# Altium project PlusBit PCB.PrjPcb
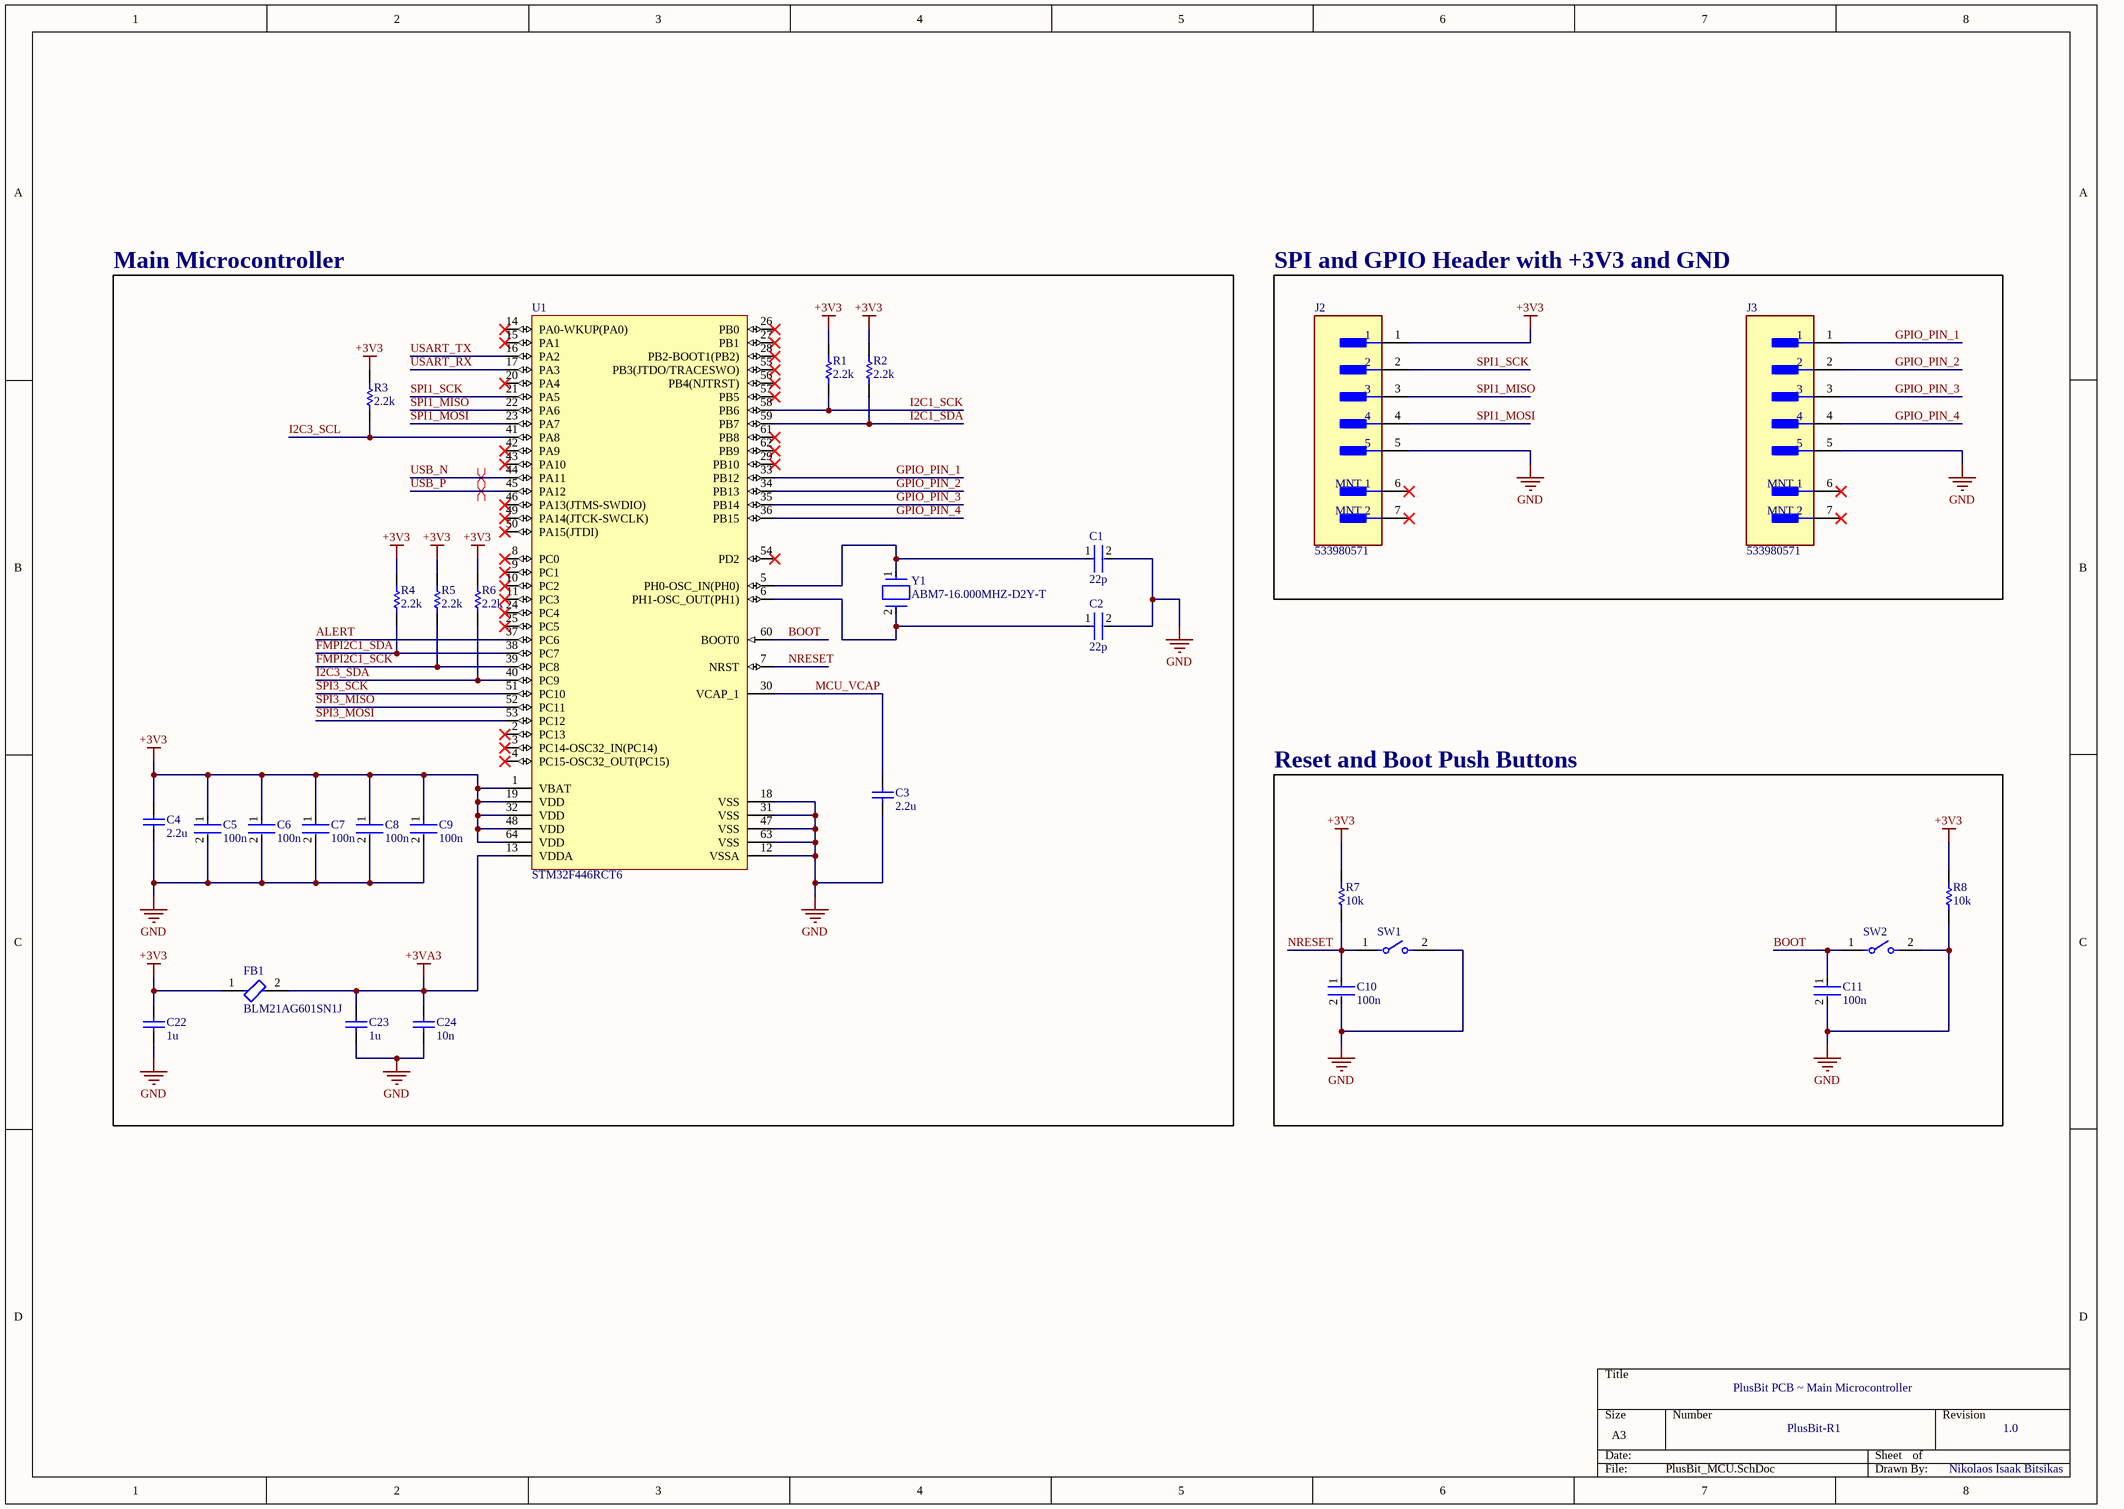
[diagram p0: PlusBit_MCU.SchDoc]
5 sheets, 66 parts. Net scope: global (net labels, ports and power ports of the same name join across sheets).
Board file: PlusBit_PCB.PcbDoc
Sheets:
  PlusBit_MCU.SchDoc
  PlusBit_PowerSupply.SchDoc
  PlusBit_ExtraModule.SchDoc
  PlusBit_ExtraMemory.SchDoc
  PlusBit_Sensors.SchDoc

## Sheet PlusBit_MCU.SchDoc
size A3; SheetNumber: 1; SheetTotal: 5

### Parts
C1  22p  [FP-C1206C-EB-MFG]
C2  22p  [FP-C1206C-EB-MFG]
C3  2.2u  [CAPC2013X145X50ML20T25]
C4  2.2u  [CAPC2013X145X50ML20T25]
C5  100n  [FP-C0402-BB-MFG]
C6  100n  [FP-C0402-BB-MFG]
C7  100n  [FP-C0402-BB-MFG]
C8  100n  [FP-C0402-BB-MFG]
C9  100n  [FP-C0402-BB-MFG]
C10  100n  [FP-C0402-BB-MFG]
C11  100n  [FP-C0402-BB-MFG]
C22  1u  [CAPC2013X135X45LL10T25]
C23  1u  [CAPC2013X135X45LL10T25]
C24  10n  [CAPC2013X88X50LL20T25]
FB1  BLM21AG601SN1J  [FP-BLM21-0_2-t0_85-e0_5-IPC_A]
J2  533980571  [FP-533980571-MFG]
J3  533980571  [FP-533980571-MFG]
R1  2.2k  [RESC1608X55X25LL10T15]
R2  2.2k  [RESC1608X55X25LL10T15]
R3  2.2k  [RESC1608X55X25LL10T15]
R4  2.2k  [RESC1608X55X25LL10T15]
R5  2.2k  [RESC1608X55X25LL10T15]
R6  2.2k  [RESC1608X55X25LL10T15]
R7  10k  [RESC2013X60X35NL10T20]
R8  10k  [RESC1608X55X25ML10T15]
SW1  FSM2JART  [FP-FSM2JART-MFG]  (value not drawn)
SW2  FSM2JART  [FP-FSM2JART-MFG]  (value not drawn)
U1  STM32F446RCT6  [STM-LQFP64_L]
Y1  ABM7-16.000MHZ-D2Y-T  [FP-ABM7-MFG]

### Blocks framed on the sheet
Main Microcontroller: C1-C9 C22-C24 FB1 R1-R6 U1 Y1
SPI and GPIO Header with +3V3 and GND: J2 J3
Reset and Boot Push Buttons: C10 C11 R7 R8 SW1 SW2

### Nets
+3V3: C4.2 C5.1 C6.1 C7.1 C8.1 C9.1 C22.2 FB1.1 J2.1 R1.2 R2.2 R3.2 R4.2 R5.2 R6.2 R7.2 R8.2 U1.1(VBAT) U1.19(VDD) U1.32(VDD) U1.48(VDD) U1.64(VDD)
+3VA3: C23.2 C24.2 FB1.2 U1.13(VDDA)
GND: C1.2 C2.2 C3.1 C4.1 C5.2 C6.2 C7.2 C8.2 C9.2 C10.2 C11.2 C22.1 C23.1 C24.1 J2.5 J3.5 R8.1 SW1.2 SW2.2 U1.12(VSSA) U1.18(VSS) U1.31(VSS) U1.47(VSS) U1.63(VSS)
ALERT: U1.37(PC6)
BOOT: C11.1 SW2.1 U1.60(BOOT0)
FMPI2C1_SCK: R5.1 U1.39(PC8)
FMPI2C1_SDA: R4.1 U1.38(PC7)
GPIO_PIN_1: J3.1 U1.33(PB12)
GPIO_PIN_2: J3.2 U1.34(PB13)
GPIO_PIN_3: J3.3 U1.35(PB14)
GPIO_PIN_4: J3.4 U1.36(PB15)
I2C1_SCK: R1.1 U1.58(PB6)
I2C1_SDA: R2.1 U1.59(PB7)
I2C3_SCL: R3.1 U1.41(PA8)
I2C3_SDA: R6.1 U1.40(PC9)
MCU_VCAP: C3.2 U1.30(VCAP_1)
NRESET: C10.1 R7.1 SW1.1 U1.7(NRST)
SPI1_MISO: J2.3 U1.22(PA6)
SPI1_MOSI: J2.4 U1.23(PA7)
SPI1_SCK: J2.2 U1.21(PA5)
SPI3_MISO: U1.52(PC11)
SPI3_MOSI: U1.53(PC12)
SPI3_SCK: U1.51(PC10)
USART_RX: U1.17(PA3)
USART_TX: U1.16(PA2)
USB_N: U1.44(PA11)
USB_P: U1.45(PA12)
NetC1_1: C1.1 U1.5(PH0-OSC_IN(PH0)) Y1.1
NetC2_1: C2.1 U1.6(PH1-OSC_OUT(PH1)) Y1.2

Not connected (* = marked no-connect by the designer): J2 6(MNT_1)* 7(MNT_2)*; J3 6(MNT_1)* 7(MNT_2)*; U1 2(PC13)* 3(PC14-OSC32_IN(PC14))* 4(PC15-OSC32_OUT(PC15))* 8(PC0)* 9(PC1)* 10(PC2)* 11(PC3)* 14(PA0-WKUP(PA0))* 15(PA1)* 20(PA4)* 24(PC4)* 25(PC5)* 26(PB0)* 27(PB1)* 28(PB2-BOOT1(PB2))* 29(PB10)* 42(PA9)* 43(PA10)* 46(PA13(JTMS-SWDIO))* 49(PA14(JTCK-SWCLK))* 50(PA15(JTDI))* 54(PD2)* 55(PB3(JTDO/TRACESWO))* 56(PB4(NJTRST))* 57(PB5)* 61(PB8)* 62(PB9)*

### Layout directives
differential pair: USB_N, USB_P

### Notes on the sheet
- PlusBit PCB ~ Main Microcontroller
- PlusBit-R1
- 1.0
- Nikolaos Isaak Bitsikas

### Library data of the parts
C1 C2 = CMP-1037-00978-2: 1206 22pF Ceramic Multilayer Capacitor; 50VDC; 125degC; C0G Dielec; +/-5% SMD; Manufacturer Part Number: C1206C220J5GACTU; Manufacturer: KEMET; Automotive Grade: Grade 0; Temperature Coefficient: 15%; Tolerance: 0.05; Voltage Rating: 50 V; Height: 0.88mm; Mouser Description: 1206 22pF Ceramic Multilayer Capacitor; 50VDC; 125degC; C0G Dielec; +/-5% SMD; Ipc Land Pattern Name: CAPC320160X78; Temperature Range High: +150°C; Automotive: Yes; Device Class L3: Ceramic Capacitors; ComponentLink2Description: Datasheet; Temperature: -55°C to +150°C; Lead Free: Yes; Category: Cap; Device Class L2: Capacitors; Device Class L1: Passive Components; Value: 22 pF; Capacitance: 22 pF; Digikey Description: 1206 22pF Ceramic Multilayer Capacitor; 50VDC; 125degC; C0G Dielec; +/-5% SMD; Octopart: https://octopart.com/c1206c220j5gactu-kemet-131912; Material: Ceramic; Temperature Characteristic: C0G; Package: C1206C-EB; RoHS: TRUE; ComponentLink2URL: https://content.kemet.com/datasheets/KEM_C1007_X8R_ULTRA_150C_SMD.pdf; Temperature Range Low: -55°C
C3 C4 = CMP-1036-04819-2: Part Number: C0805C225K9PACTU; Manufacturer: Kemet
C5-C9 C11 = CMP-2008-02046-2: CAP CER 0.1UF 10V X5R 0402; Manufacturer: Kemet; Manufacturer Part Number: C0402C104K8PACTU; Material: Ceramic; Capacitance: 0.10 μF; Temperature Coefficient: 15%; Tolerance: 0.1; Value: 0.10 μF; Package: C0402-BB; Temperature: -55°C to +125°C; ComponentLink2Description: Datasheet; Temperature Characteristic: X5R; Device Class L1: Passive Components; Height: 0.55mm; Lead Free: Yes; ComponentLink2URL: https://content.kemet.com/datasheets/KEM_C1002_X7R_SMD.pdf; Device Class L2: Capacitors; Temperature Range Low: -55°C; Temperature Range High: +125°C; RoHS: TRUE; Octopart: https://octopart.com/c0402c104k8pactu-kemet-140039; Automotive: No; Mouser Description: Capacitor 100 nF 10 VDC 0402; Category: Cap; Voltage Rating: 10 V; Digikey Description: CAP CER 0.1UF 10V X5R 0402; Ipc Land Pattern Name: CAPC10050X50; Device Class L3: Ceramic Capacitors
C10 = CMP-2008-02108-2: CAP CER 0.1UF 16V X7R 0402; Manufacturer: Kemet; Manufacturer Part Number: C0402C104K4RACTU; Value: 0.10 μF; Tolerance: 0.1; Material: Ceramic; Temperature Coefficient: 15%; Voltage Rating: 16 V; Package: C0402-BB; Automotive: No; Ipc Land Pattern Name: CAPC10050X50; Device Class L3: Ceramic Capacitors; Capacitance: 0.10 μF; Octopart: https://octopart.com/c0402c104k4ractu-kemet-94158; Temperature Characteristic: X7R; Mouser Description: Cap Ceramic 0.1uF 16V X7R 10% SMD 0402 125?C Paper T/R - Tape and Reel (Alt: C0402C104K4RAC TU); ComponentLink2Description: Datasheet; Temperature Range Low: -55°C; RoHS: TRUE; Device Class L1: Passive Components; Temperature Range High: +125°C; Device Class L2: Capacitors; ComponentLink2URL: https://content.kemet.com/datasheets/KEM_C1002_X7R_SMD.pdf; Category: Cap; Height: 0.55mm; Temperature: -55°C to +125°C; Lead Free: Yes; Digikey Description: CAP CER 0.1UF 16V X7R 0402
C22 C23 = CMP-1036-04761-2: Manufacturer: Murata; Part Number: GRM21BR71H105KA12L
C24 = CMP-2007-00266-1: Manufacturer: Kemet; Part Number: C0805C103K5RACTU
FB1 = CMP-0686-00643-3: Chip Ferrite Bead, 0805, 600Ω @ 100MHz, 0.2Ω, 25%, 700mA; Current Rating: 600mA; Impedance: 600R; DC Resistance (DCR): 210mR; Max Current Rating: 200mA; Number of Circuits: 1; RoHS Compliant: Yes; Test Frequency: 100MHz; Number of Pins: 2; Case Code (Metric): 2012; Depth: 0.85mm; Height: 1.25mm; Case Code (Imperial): 0805; Case/Package: 0805; DC Current: 200mA; Max Operating Temperature: 125°C; Core Material: Ferrite; Length: 2.2mm; Tolerance: 25%; Packaging: Tape and Reel; Min Operating Temperature: -55°C; Radiation Hardening: No; Termination: Flat
J2 J3 = CMP-2000-05250-2: CONN HEADER SMD 5POS 1.25MM; Manufacturer: Molex; Number Of Contacts: 5; Conn Orientation: Vertical; Current Rating: 1A; Voltage Rating: 125V; Conn Gender: Male; Standoff Height: 0.05mm; Package: CONN_HDR5; Contact Material: Tin,Nickel; ComponentLink2Description: Datasheet; Footprint Url: https://www.molex.com/pdm_docs/sd/533980571_sd.pdf; Device Class L3: unset; Manufacturer Part Number: 533980571; Digikey Description: CONN HEADER SMD 5POS 1.25MM; Automotive: No; Lead Free: Yes; Device Class L1: Connectors; Temperature Range High: +105°C; Number Of Rows: 1; Mouser Description: Wire-To-Board Connector, Vertical, PicoBlade 53398 Series, Surface Mount, Header, 5, 1.25 mm; Octopart: https://octopart.com/53398-0571-molex-655292; ComponentLink2URL: https://www.molex.com/webdocs/datasheets/pdf/en-us/0533980571_PCB_HEADERS.pdf; Category: Conn; Device Class L2: Headers and Wire Housings; Pitch: 1.25mm; Ipc Land Pattern Name: HDRV5W64P254_1X5_2032X64X457; RoHS: TRUE; Temperature: -40°C to +105°C; Height: 4.9mm; Temperature Range Low: -40°C
R1-R6 = CMP-2000-06934-1: Thick Film Resistor, 2.2 KOhm, 100 mW, 50 V, +/- 1%, -55 to 155 degC, 2-Pin SMD (0603), RoHS, Tape and Reel; Manufacturer: Yageo; Resistance: 2.2kOhms; Temperature Coefficient: 100PPM/C; Voltage Rating: 50V; Power Rating: 100mW; Tolerance: 1%; Datasheet Version: Rev. 7, 05/2017; Case Code - mm: 1608; Series: RC; Mounting Technology: SurfaceMount; Package Description: 2-Pin Surface Mount Device, Body 1.6 x 0.8 mm; Case Code - in: 0603; Package Reference: 0603; Product: ThickFilmResistorsGeneralPurpose; Manufacturer URL: http://www.yageo.com/; Termination Style: SMD/SMT; Operating Temperature Range: -55Cto+155C; Datasheet URL: http://www.yageo.com/documents/recent/PYu-RC_Group_51_RoHS_L_7.pdf; Packaging: Reel
R7 = CMP-1659-00013-4: Chip Resistor, 10 KOhm, +/- 1%, 0.125 W, -55 to 155 degC, 0805 (2012 Metric), RoHS, Tape and Reel; Manufacturer: Yageo; Voltage Rating: 150 V; Mount: Surface Mount; ComponentLink1Description: Manufacturer URL; ComponentLink2URL: http://www.yageo.com/documents/recent/PYu-RC_Group_51_RoHS_L_04.pdf; Pins: 2; Length: 2 mm; Min Operating Temperature: -55 degC; Height: 0.5 mm; Mounting Technology: Surface Mount; RoHSCompliant: true; REACH SVHC: No SVHC; ComponentLink1URL: http://www.yageo.com/; Max Operating Temperature: 155 degC; PackageReference: 0805; DatasheetVersion: Rev. 4, 02/2016; Package Quantity: 5000; Packaging: Tape and Reel; ComponentLink2Description: Datasheet; PackageDescription: 2-Pin Surface Mounted Device, Body 2 x 1.25 mm
R8 = CMP-2000-05022-1: Resistor, 10 KOhm, +/- 5%, 100 mW, -55 to 155 degC, 0603 (1608 Metric), RoHS, Tape and Reel; Manufacturer: Yageo; Resistance: 10kOhms; Voltage Rating: 50V; Temperature Coefficient: 100PPM/C; Power Rating: 100mW; Package Reference: 603; Series: RC; Case Code - mm: 1608; Packaging: Reel; Datasheet URL: http://www.farnell.com/datasheets/443971.pdf; Datasheet Version: Rev. 4, 04/2009; Operating Temperature Range: -55Cto+155C; Product: ThickFilmResistorsGeneralPurpose; Package Description: 2-Pin Surface Mount Device, Body 1.6 x 0.8 mm; Manufacturer URL: http://www.yageo.com/; Case Code - in: 0603; Tolerance: 5%; Termination Style: SMD/SMT
SW1 SW2 = CMP-03407-000009-1: SWITCH TACTILE SPST-NO 0.05A 12V; Actuator Length: 0.7mm; Switch Function: Off-Mom; Throw Configuration: SPST; Electrical Life: 100000Cycles; Illumination Type: Non-Illuminated; Contact Resistance: 100mR; Operating Force: 260gf; Actuator Type: Standard; Actuator Material: Resin; Contact Current Rating: 50mA; Type: Switch; Contact Plating: Silver; ELV: Compliant; Lead Free: Lead Free; Max Voltage Rating (DC): 12V; Min Operating Temperature: -35°C; Mount: Through Hole; Series: FSMJRT; Max Operating Temperature: 105°C; RoHS Compliant: Yes; Termination: Solder; REACH SVHC: No SVHC; Contact Material: Copper Alloy; Orientation: Straight; Current Rating: 50mA; Package Quantity: 1000; Voltage Rating (DC): 12V; Packaging: Tape and Reel
U1 = CMP-0243-00216-1: ARM Cortex-M4 32-bit MCU+FPU, 256 KB Flash, 128 KB Internal RAM, 50 I/Os, 64-Pin LQFP, -40 to 85 degC, Tray; Operating Frequency(F) (Processor speed) (MHz): 180; Internal RAM Size (kB): 128; I/Os (High Current): 50; FLASH Size (Prog) (kB): 256; D/A Converter: 2; Supply Voltage(Vcc) min (V): 1.7; Mounting Technology: Surface Mount; DatasheetVersion: Rev. 6; ComponentLink1URL: http://www.st.com/; Package Description: LQFP64; ComponentLink1Description: Manufacturer URL; Packing: Tray; ComponentLink2Description: Datasheet; Core: ARM Cortex-M4; Package Reference: 64-Pin Low-profile Quad Flat Package, Body 10 x 10 mm, Pitch 0.5 mm; ComponentLink2URL: http://www.st.com/st-web-ui/static/active/en/resource/technical/document/datasheet/DM00141306.pdf
Y1 = CMP-27762-000095-1: Crystal 16MHz ±20ppm 18pF SMD-2 6mm x 3.5mm; ESR (Equivalent Series Resistance): 50R; Frequency Stability: 30ppm; Width: 3.3mm; Frequency: 16MHz; Radiation Hardening: No; Height: 0.055inch; Tolerance: 20ppm; Length: 6mm; Case/Package: CSMD; Lead Free: Lead Free; Min Operating Temperature: -40°C; Termination: SMD/SMT; Operating Frequency: 16 MHz; Resistor Type: Ceramic; Packaging: Tape and Reel; Mount: Surface Mount; Load Capacitance: 18pF; Frequency Tolerance: 20ppm; Depth: 3.5mm; Series: ABM7; Package Quantity: 1000; Max Operating Temperature: 85°C; Number of Pins: 2

## Sheet PlusBit_PowerSupply.SchDoc
size A4; SheetNumber: 2; SheetTotal: 5
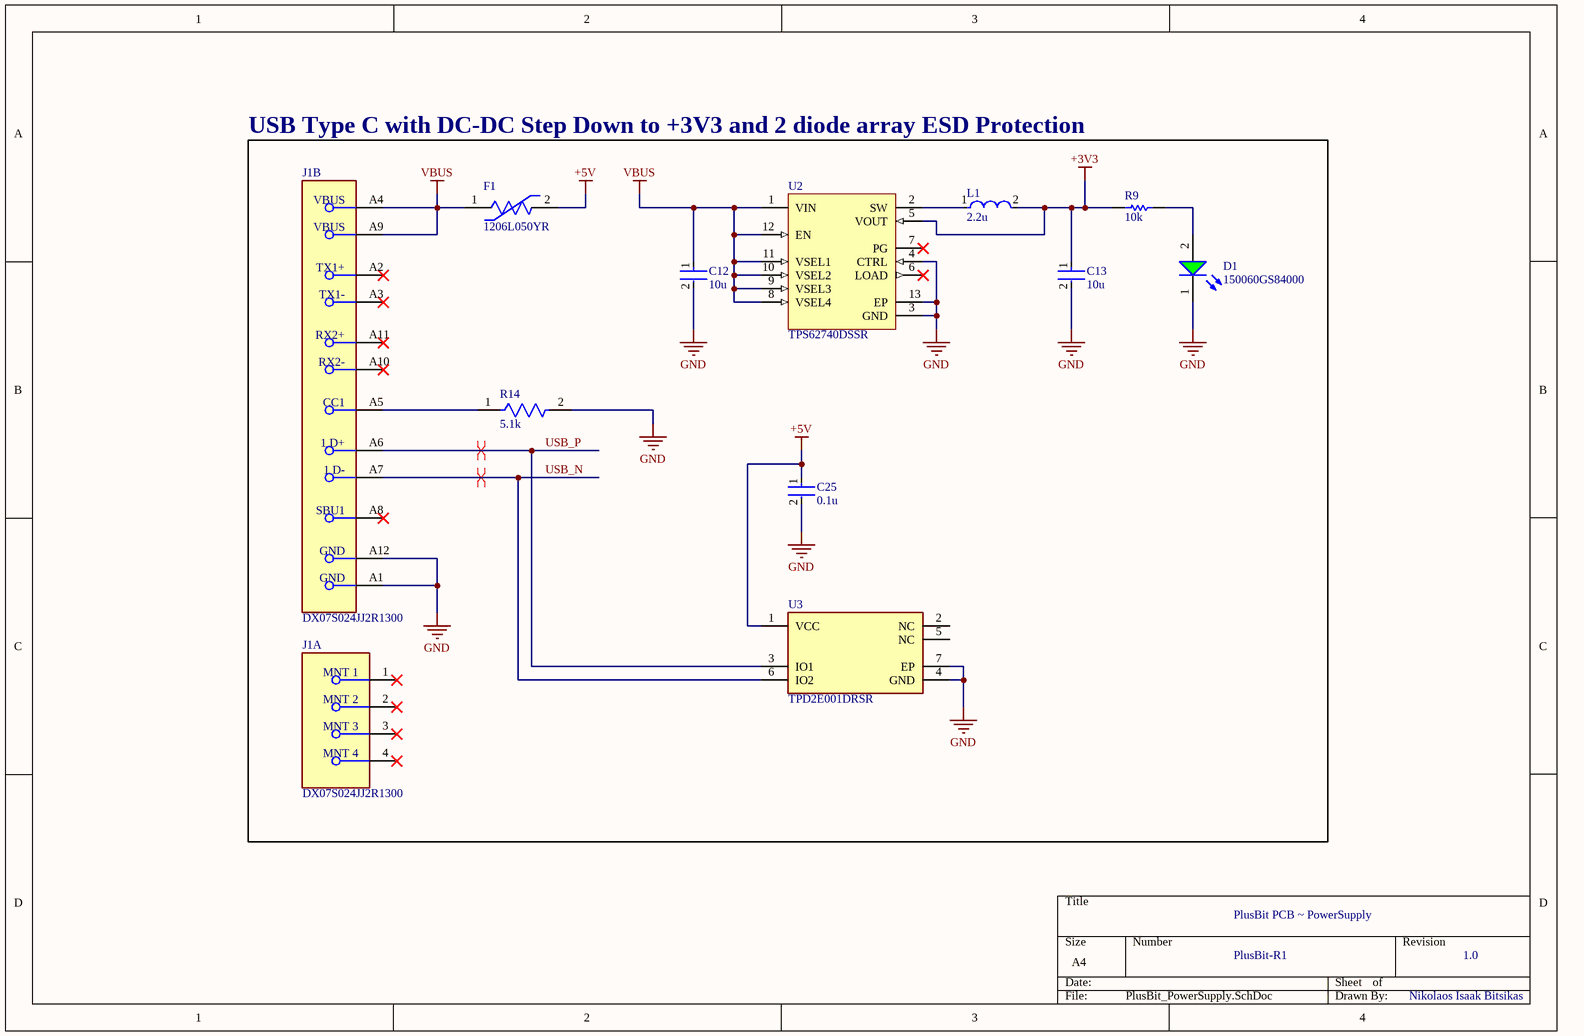
[diagram p1: PlusBit_PowerSupply.SchDoc]

### Parts
C12  10u  [FP-GRM188-0_1-e0_2_0_55-IPC_A]
C13  10u  [FP-GRM188-0_1-e0_2_0_55-IPC_A]
C25  0.1u  [FP-C0402-BB-MFG]
D1  150060GS84000  [WL-SMCW_0603_150060xx8x000]
F1  1206L050YR  [FP-1206L050YR-MFG]
J1  DX07S024JJ2R1300  [FP-DX07S024JJ2R1300-MFG]  (parts A,B of 3)
L1  2.2u  [FP-LQM2HPN_G0-IPC_C]
R9  10k  [RESC1608X55X25ML10T15]
R14  5.1k  [FP-CRCW0603-e3-IPC_C]
U2  TPS62740DSSR  [DSS0012A_V]
U3  TPD2E001DRSR  [FP-DRS0006A-MFG]

### Nets
+3V3: C13.1 L1.2 R9.2 U2.5(VOUT)
+5V: C25.1 F1.2 U3.1(VCC)
GND: C12.2 C13.2 C25.2 D1.1(K) J1.A1(GND) J1.A12(GND) R14.2 U2.3(GND) U2.4(CTRL) U2.13(EP) U3.4(GND) U3.7(EP)
VBUS: C12.1 F1.1 J1.A4(VBUS) J1.A9(VBUS) U2.1(VIN) U2.8(VSEL4) U2.9(VSEL3) U2.10(VSEL2) U2.11(VSEL1) U2.12(EN)
USB_N: J1.A7(1_D-) U3.6(IO2)
USB_P: J1.A6(1_D+) U3.3(IO1)
NetD1_2: D1.2(A) R9.1
NetJ1_A5: J1.A5(CC1) R14.1
NetL1_1: L1.1 U2.2(SW)

Not connected (* = marked no-connect by the designer): J1 1(MNT_1)* 2(MNT_2)* 3(MNT_3)* 4(MNT_4)* A2(TX1+)* A3(TX1-)* A8(SBU1)* A10(RX2-)* A11(RX2+)*; U2 6(LOAD)* 7(PG)*; U3 2(NC) 5(NC)

### Layout directives
differential pair: USB_N, USB_P

### Notes on the sheet
- USB Type C with DC-DC Step Down to +3V3 and 2 diode array ESD Protection
- PlusBit PCB ~ PowerSupply
- PlusBit-R1
- 1.0
- Nikolaos Isaak Bitsikas

### Library data of the parts
C12 C13 = CMP-2006-02792-2: Chip Multilayer Ceramic Capacitors for General Purpose, 0603, 10uF, X5R, 15%, 20%, 6.3V; Packaging: Tape and Reel; Voltage Rating (DC): 6.3V; Width: 0.031inch; Termination: SMD/SMT; Dielectric: X5R; Package Quantity: 4000; Voltage Rating: 6.3V; Capacitance: 10uF; Case/Package: 0603; Min Operating Temperature: -55°C; Voltage: 6.3V; Length: 1.6mm; Thickness: 0.035inch; Lead Free: Lead Free; Depth: 0.8mm; Case Code (Imperial): 0603; Max Operating Temperature: 85°C; Material: Ceramic; Height: 0.8mm; Tolerance: 20%; Mount: Surface Mount; REACH SVHC: No SVHC; Radiation Hardening: No; Case Code (Metric): 1608
C25 = CMP-2008-02108-2: as C10 on sheet PlusBit_MCU; Voltage Rating: 16 V; Package: C0402-BB; Automotive: No; Ipc Land Pattern Name: CAPC10050X50; Device Class L3: Ceramic Capacitors; Capacitance: 0.10 μF; Octopart: https://octopart.com/c0402c104k4ractu-kemet-94158; Temperature Characteristic: X7R; Mouser Description: Cap Ceramic 0.1uF 16V X7R 10% SMD 0402 125?C Paper T/R - Tape and Reel (Alt: C0402C104K4RAC TU); ComponentLink2Description: Datasheet; Temperature Range Low: -55°C; RoHS: TRUE; Device Class L1: Passive Components; Temperature Range High: +125°C; Device Class L2: Capacitors; ComponentLink2URL: https://content.kemet.com/datasheets/KEM_C1002_X7R_SMD.pdf; Category: Cap; Height: 0.55mm; Temperature: -55°C to +125°C; Lead Free: Yes; Digikey Description: CAP CER 0.1UF 16V X7R 0402
D1 = CMP-03913-108242102-2: WL-SMCW SMT Mono-color Chip LED Waterclear; Forward Voltage: 3.3V; Dominant Wavelength: 525nm; Max Reverse Voltage (DC): 5V; Viewing Angle: 40°; Luminous Intensity: 3cd; Peak Wavelength: 520nm; Forward Current: 30mA; Length: 1.6mm; Height: 950µm; Max Operating Temperature: 85°C; Min Operating Temperature: -40°C; RoHS: Compliant; Width: 800µm
F1 = CMP-08606-000073-1: PTC RESET FUSE 6V 500MA 1206; Trip Current: 1A; Current Rating: 100A; Resistance: 700mR; Approvals: cULus; Max Power Dissipation: 600mW; Time to Trip: 0.1s; Hold Current: 500mA; Min Operating Temperature: -40°C; Voltage Rating (DC): 6V; Working Voltage: 6V; Package Quantity: 4000; Termination: SMD/SMT; Lead Free: Lead Free; REACH SVHC: No SVHC; Series: 1206L; Max Voltage Rating (DC): 6V; Height: 0.75mm; Terminal Material: Copper; Packaging: Tape and Reel; Case Code (Imperial): 1206; Length: 3.4mm; RoHS Compliant: Yes; Operating Supply Voltage: 6V; Case Code (Metric): 3216; Width: 1.8mm; Max Current Rating: 100A; Case/Package: 1206; Power Dissipation: 600mW; Max Operating Temperature: 85°C; Voltage Rating: 6V
J1 = CMP-19038-000004-1: CONN RCP USB3.1 TYPEC 24P SMD RA; Number of Contacts: 24; Gender: Receptacle; Connector Type: USB; Features: Shielded; Packaging: Tape and Reel; Mount: Surface Mount; RoHS Compliant: Yes
L1 = CMP-1662-00028-2: Multilayer Type Inductor for Power Lines, 1008 (2520), 2.2μH, 20%, 0.1Ω, 1.3A; Core Material: Ferrite; DC Resistance (DCR): 100mR; Inductance: 2.2uH; Test Frequency: 1MHz; Self Resonant Frequency: 40MHz; Shielding: Shielded; Depth: 2.2mm; Length: 2.5mm; Max DC Current: 1.3A; Military Standard: Not; Current Rating: 1.3A; Termination: SMD/SMT; Radiation Hardening: No; Tolerance: 20%; Height: 1.2mm; Case Code (Metric): 2520; DC Current: 1.3A; Inductance Tolerance: 20%; Packaging: Tape and Reel; Width: 2mm; REACH SVHC: No SVHC; Mount: Surface Mount; Max Operating Temperature: 125°C; Lead Free: Lead Free; Case/Package: 1008; Case Code (Imperial): 1008; Series: LQM2HP_G0; Height - Seated (Max): 0.039inch; Package Quantity: 3000; Min Operating Temperature: -55°C
R9 = CMP-2000-05022-1: as R8 on sheet PlusBit_MCU; Package Reference: 603; Series: RC; Case Code - mm: 1608; Packaging: Reel; Datasheet URL: http://www.farnell.com/datasheets/443971.pdf; Datasheet Version: Rev. 4, 04/2009; Operating Temperature Range: -55Cto+155C; Product: ThickFilmResistorsGeneralPurpose; Package Description: 2-Pin Surface Mount Device, Body 1.6 x 0.8 mm; Manufacturer URL: http://www.yageo.com/; Case Code - in: 0603; Tolerance: 5%; Termination Style: SMD/SMT
R14 = CMP-1012-00590-3: RES Thick Film, 5.1kΩ, 1%, 0.1W, 100ppm/°C, 0603; Power Rating: 100mW; Voltage Rating (DC): 75V; Resistance: 5.1kR; Width: 0.85mm; Depth: 0.85mm; Military Standard: Not; Package Quantity: 5000; Case Code (Metric): 1608; Length: 1.55mm; Weight: 7.1E-05oz; Packaging: Tape and Reel; Temperature Coefficient: 100ppm/°C; Case Code (Imperial): 0603; Lead Free: Lead Free; Radiation Hardening: No; Contact Plating: Tin; Composition: Thick Film; Max Operating Temperature: 155°C; Termination: SMD/SMT; Case/Package: 0603; Min Operating Temperature: -55°C; Tolerance: 1%; Voltage Rating: 75V; Mount: Surface Mount; Height: 0.45mm
U2 = CMP-0323-00572-2: Step Down Converter For Low Power Applications, 2.2 to 5.5 V VIN, -40 to 85 degC, 12-Pin WSON (DSS), RoHS, Tape and Reel; VOUT Max: 3.3 V; VIN Min: 2.2 V; VIN Max: 5.5 V; VOUT Min: 1.8 V; ComponentLink1URL: http://www.ti.com/; PackageReference: DSS0012A; ComponentLink2URL: http://www.ti.com/lit/ds/symlink/tps62740.pdf; Packing: Tape and Reel; DatasheetVersion: SLVSB02B; ComponentLink3Description: Package Specification; Temperature Max: 85 degC; RoHS: TRUE; PartNumber: TPS62740; PackageVersion: 4209244/C, 07/2011; PackageDescription: 12-Pin Plastic Small Outline, Body 3 x 2 mm, Pitch 0.5 mm; Mounting Technology: Surface Mount; ComponentLink1Description: Manufacturer URL; Temperature Min: -40 degC; ComponentLink2Description: Datasheet; ComponentLink3URL: http://www.ti.com/litv/pdf/mpds336b
U3 = CMP-0326-00040-4: TVS DIODE 5.5V 6SON; Capacitance: 1.5pF; Clamping Voltage: 105.5V; Min Breakdown Voltage: 11V; Element Configuration: Dual; Test Current: 10mA; Power Line Protection: Yes; Number of Bidirectional Channels: 2; Interface: LVDS; Leakage Current: 1nA; Direction: Unidirectional; REACH SVHC: No SVHC; Operating Supply Voltage: 5.5V; Contact Plating: Gold; Min Operating Temperature: -40°C; Max Operating Temperature: 85°C; Length: 3mm; Termination: SMD/SMT; Radiation Hardening: No; Reverse Standoff Voltage: 5.5V; ESD Protection: Yes; Package Quantity: 1; Number of Pins: 6; Height: 0.55mm; Width: 1.3mm; Packaging: Tape and Reel; Max Reverse Leakage Current: 1nA; Number of Channels: 2; Depth: 3mm; Lead Free: Lead Free; RoHS Compliant: Yes

## Sheet PlusBit_ExtraModule.SchDoc
size A4; SheetNumber: 3; SheetTotal: 5
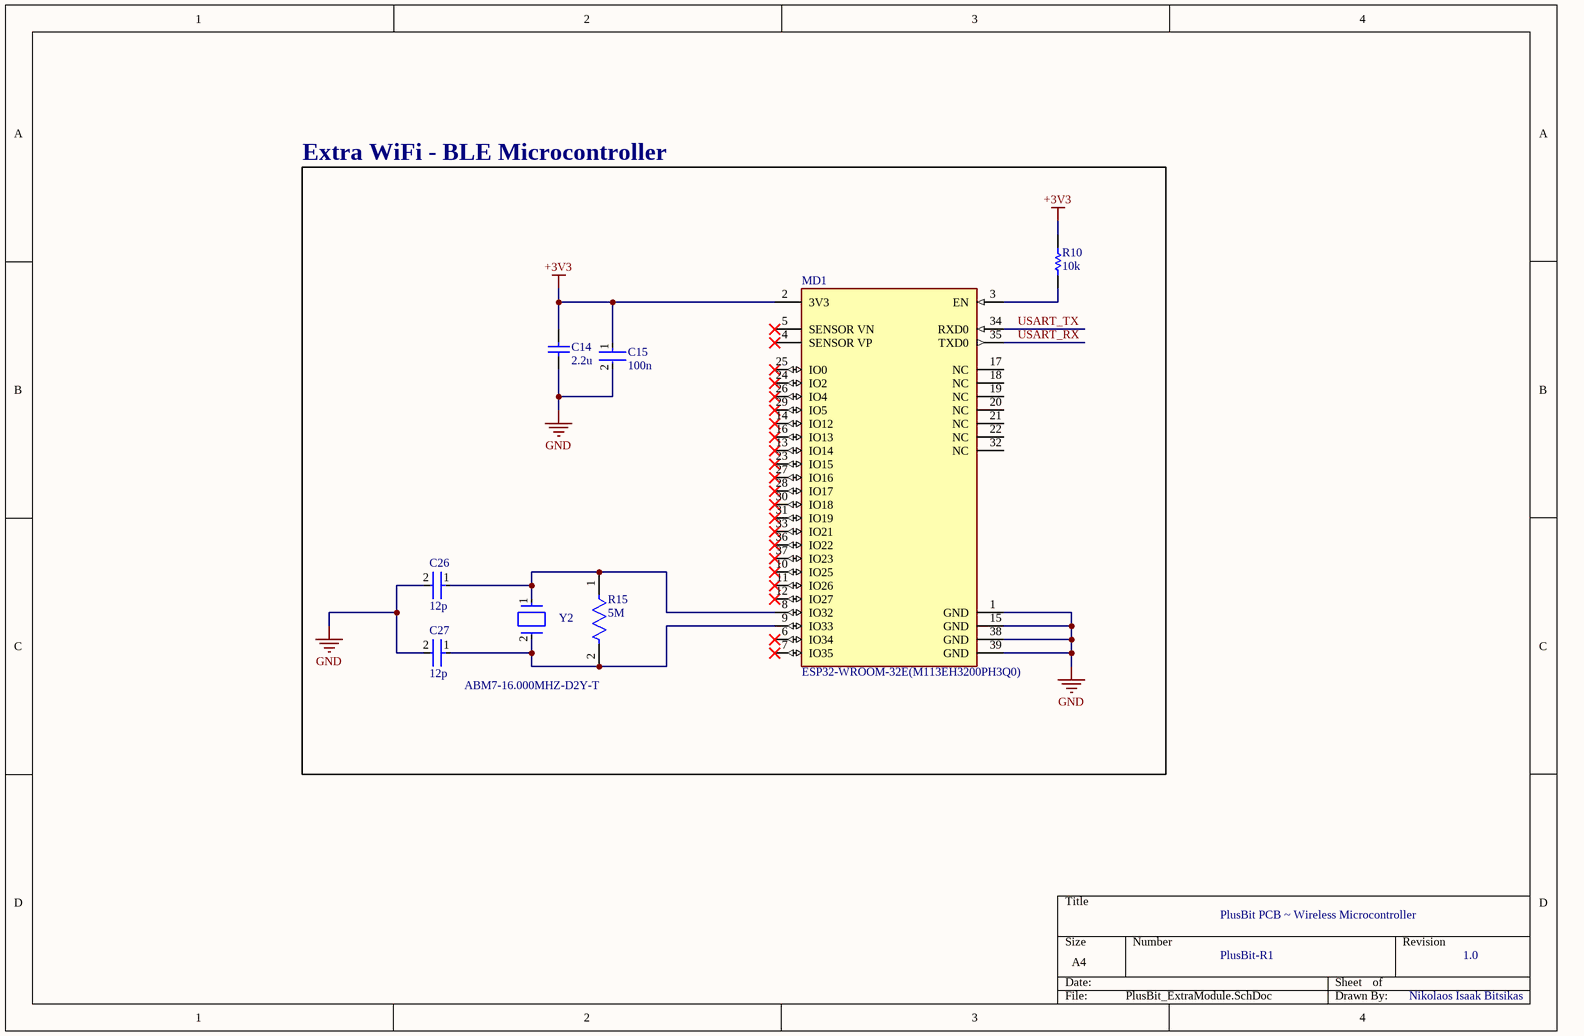
[diagram p2: PlusBit_ExtraModule.SchDoc]

### Parts
C14  2.2u  [CAPC2013X145X50ML20T25]
C15  100n  [FP-C0402-BB-MFG]
C26  12p  [FP-C0402-BB-MFG]
C27  12p  [FP-C0402-BB-MFG]
MD1  ESP32-WROOM-32E(M113EH3200PH3Q0)  [FP-ESP32-WROOM-32E_M113EH-MFG]
R10  10k  [RESC1608X55X25ML10T15]
R15  5M  [FP-WSLP0805-MFG]
Y2  ABM7-16.000MHZ-D2Y-T  [FP-ABM7-MFG]

### Blocks framed on the sheet
Extra WiFi - BLE Microcontroller: C14 C15 C26 C27 MD1 R10 R15 Y2

### Nets
+3V3: C14.2 C15.1 MD1.2(3V3) R10.2
GND: C14.1 C15.2 C26.2 C27.2 MD1.1(GND) MD1.15(GND) MD1.38(GND) MD1.39(GND)
USART_RX: MD1.35(TXD0)
USART_TX: MD1.34(RXD0)
NetC26_1: C26.1 MD1.8(IO32) R15.1 Y2.1
NetC27_1: C27.1 MD1.9(IO33) R15.2 Y2.2
NetMD1_3: MD1.3(EN) R10.1

Not connected (* = marked no-connect by the designer): MD1 4(SENSOR_VP)* 5(SENSOR_VN)* 6(IO34)* 7(IO35)* 10(IO25)* 11(IO26)* 12(IO27)* 13(IO14)* 14(IO12)* 16(IO13)* 17(NC) 18(NC) 19(NC) 20(NC) 21(NC) 22(NC) 23(IO15)* 24(IO2)* 25(IO0)* 26(IO4)* 27(IO16)* 28(IO17)* 29(IO5)* 30(IO18)* 31(IO19)* 32(NC) 33(IO21)* 36(IO22)* 37(IO23)*

### Notes on the sheet
- PlusBit PCB ~ Wireless Microcontroller
- PlusBit-R1
- 1.0
- Nikolaos Isaak Bitsikas

### Library data of the parts
C14 = CMP-1036-04819-2: as C3 on sheet PlusBit_MCU
C15 = CMP-2008-02046-2: as C5 on sheet PlusBit_MCU; Package: C0402-BB; Temperature: -55°C to +125°C; ComponentLink2Description: Datasheet; Temperature Characteristic: X5R; Device Class L1: Passive Components; Height: 0.55mm; Lead Free: Yes; ComponentLink2URL: https://content.kemet.com/datasheets/KEM_C1002_X7R_SMD.pdf; Device Class L2: Capacitors; Temperature Range Low: -55°C; Temperature Range High: +125°C; RoHS: TRUE; Octopart: https://octopart.com/c0402c104k8pactu-kemet-140039; Automotive: No; Mouser Description: Capacitor 100 nF 10 VDC 0402; Category: Cap; Voltage Rating: 10 V; Digikey Description: CAP CER 0.1UF 10V X5R 0402; Ipc Land Pattern Name: CAPC10050X50; Device Class L3: Ceramic Capacitors
C26 C27 = CMP-1034-00770-4: CAP CER 12PF 50V C0G/NP0 0402; Manufacturer Part Number: C0402C120J5GACTU; Manufacturer: Kemet; Material: Ceramic; Temperature Coefficient: 15%; Temperature Characteristic: C0G; Tolerance: 0.05; Device Class L1: Passive Components; Octopart: https://octopart.com/c0402c120j5gactu-kemet-141377; Device Class L2: Capacitors; Value: 12 pF; Category: Cap; Package: C0402-BB; Automotive: No; ComponentLink2URL: https://content.kemet.com/datasheets/KEM_C1002_X7R_SMD.pdf; Voltage Rating: 50 V; Digikey Description: CAP CER 12PF 50V C0G/NP0 0402; Height: 0.55mm; Temperature: -55°C to +125°C; Mouser Description: Multilayer Ceramic Capacitor, C Series, 12 pF, - 5%, C0G / NP0, 50 V, 0402 [1005 Metric]; ComponentLink2Description: Datasheet; Device Class L3: Ceramic Capacitors; Lead Free: Yes; Ipc Land Pattern Name: CAPC10050X50; Temperature Range High: +125°C; RoHS: TRUE; Temperature Range Low: -55°C; Capacitance: 12 pF
MD1 = CMP-194065-000012-1: RX TXRX MOD WIFI TRACE ANT SMD
R10 = CMP-2000-05022-1: as R8 on sheet PlusBit_MCU; Package Reference: 603; Series: RC; Case Code - mm: 1608; Packaging: Reel; Datasheet URL: http://www.farnell.com/datasheets/443971.pdf; Datasheet Version: Rev. 4, 04/2009; Operating Temperature Range: -55Cto+155C; Product: ThickFilmResistorsGeneralPurpose; Package Description: 2-Pin Surface Mount Device, Body 1.6 x 0.8 mm; Manufacturer URL: http://www.yageo.com/; Case Code - in: 0603; Tolerance: 5%; Termination Style: SMD/SMT
R15 = CMP-02407-013125-1: RES 0.005 OHM 1% 1W 0805; Resistance: 5mR; Temperature Coefficient: 110ppm/°C; Length: 0.08inch; Number of Terminations: 2; Height: 0.023inch; Max Operating Temperature: 170°C; Features: Moisture Resistant; Resistor Type: Metal Strip; Tolerance: 1%; Min Operating Temperature: -65°C; Power Rating: 1W; Width: 0.05inch; Max Power Dissipation: 1W; Case Code (Metric): 2012; Case/Package: 0805; Series: WSLP-HP; Case Code (Imperial): 0805; RoHS Compliant: Yes; Resistance Tolerance: 1%; Packaging: Cut Tape
Y2 = CMP-27762-000095-1: as Y1 on sheet PlusBit_MCU; Width: 3.3mm; Frequency: 16MHz; Radiation Hardening: No; Height: 0.055inch; Tolerance: 20ppm; Length: 6mm; Case/Package: CSMD; Lead Free: Lead Free; Min Operating Temperature: -40°C; Termination: SMD/SMT; Operating Frequency: 16 MHz; Resistor Type: Ceramic; Packaging: Tape and Reel; Mount: Surface Mount; Load Capacitance: 18pF; Frequency Tolerance: 20ppm; Depth: 3.5mm; Series: ABM7; Package Quantity: 1000; Max Operating Temperature: 85°C; Number of Pins: 2

## Sheet PlusBit_ExtraMemory.SchDoc
size A3; SheetNumber: 4; SheetTotal: 5
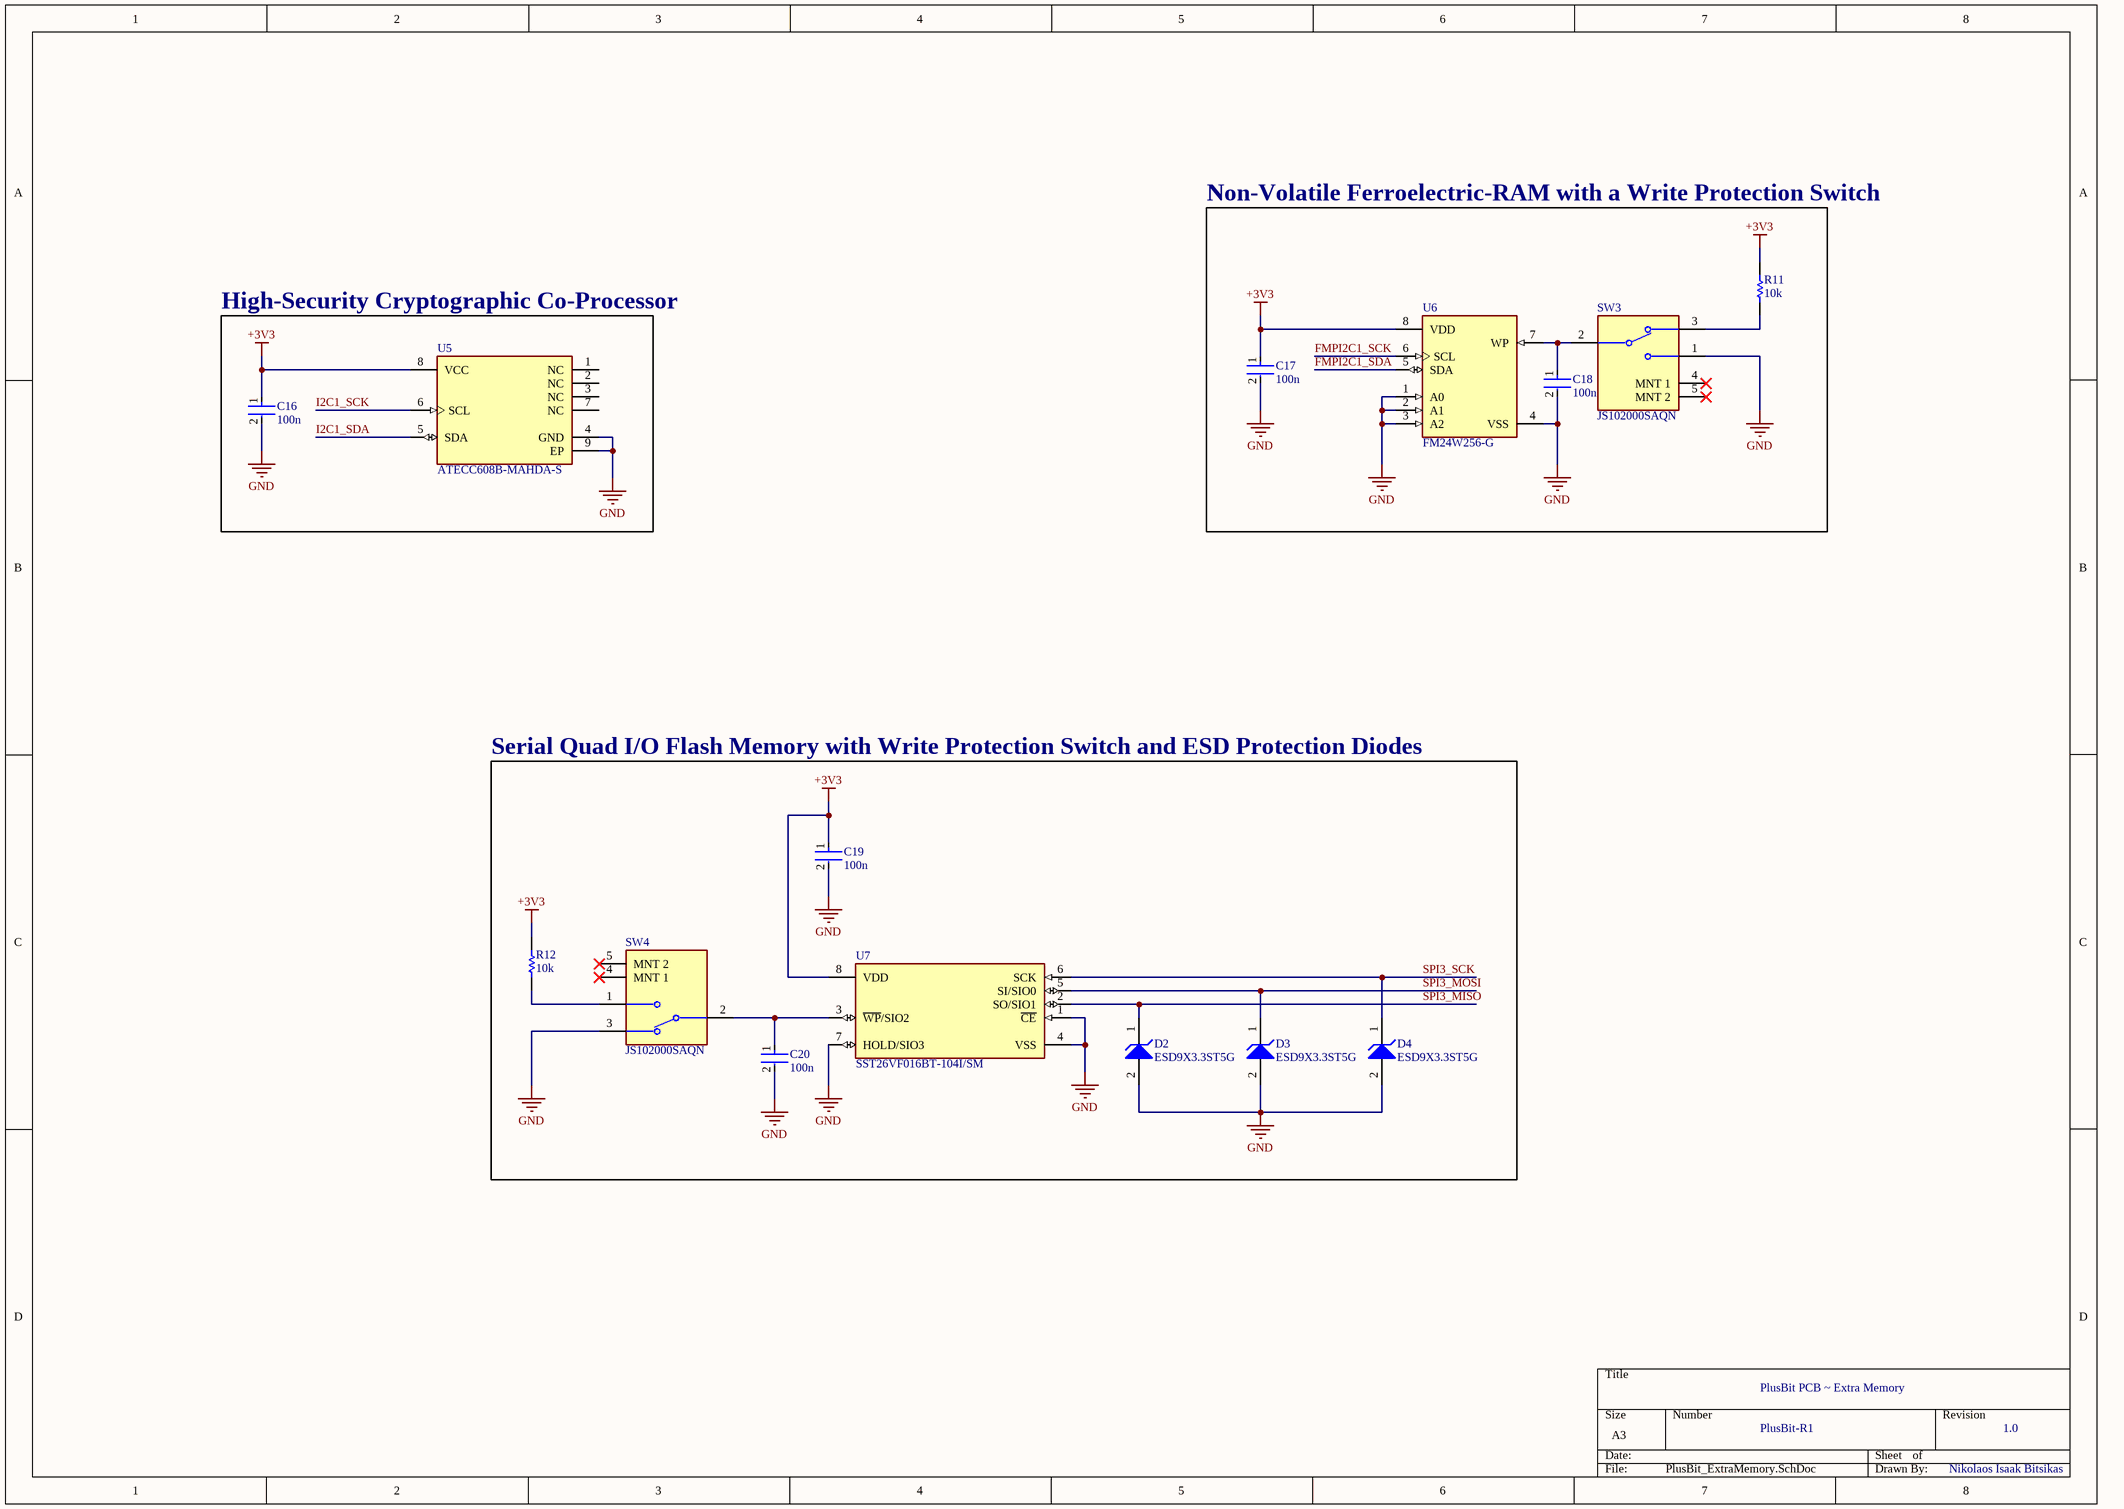
[diagram p3: PlusBit_ExtraMemory.SchDoc]

### Parts
C16  100n  [FP-C0402-BB-MFG]
C17  100n  [FP-C0402-BB-MFG]
C18  100n  [FP-C0402-BB-MFG]
C19  100n  [FP-C0402-BB-MFG]
C20  100n  [FP-C0402-BB-MFG]
D2  ESD9X3.3ST5G  [ONSC-SOD-923-2-514AA-01_V]
D3  ESD9X3.3ST5G  [ONSC-SOD-923-2-514AA-01_V]
D4  ESD9X3.3ST5G  [ONSC-SOD-923-2-514AA-01_V]
R11  10k  [RESC1608X55X25ML10T15]
R12  10k  [RESC1608X55X25ML10T15]
SW3  JS102000SAQN  [FP-JS102000SAQN-MFG]
SW4  JS102000SAQN  [FP-JS102000SAQN-MFG]
U5  ATECC608B-MAHDA-S  [FP-C04-21355-Q4B-IPC_B]
U6  FM24W256-G  [FP-51-85066-MFG]
U7  SST26VF016BT-104I/SM  [FP-C04-056-MFG]

### Blocks framed on the sheet
High-Security Cryptographic Co-Processor: C16 U5

### Nets
+3V3: C16.1 C17.1 C19.1 R11.2 R12.2 U5.8(VCC) U6.8(VDD) U7.8(VDD)
GND: C16.2 C17.2 C18.2 C19.2 C20.2 D2.2(A) D3.2(A) D4.2(A) SW3.1 SW4.3 U5.4(GND) U5.9(EP) U6.1(A0) U6.2(A1) U6.3(A2) U6.4(VSS) U7.1(~{CE}) U7.4(VSS) U7.7(HOLD/SIO3)
FMPI2C1_SCK: U6.6(SCL)
FMPI2C1_SDA: U6.5(SDA)
I2C1_SCK: U5.6(SCL)
I2C1_SDA: U5.5(SDA)
SPI3_MISO: D2.1(K) U7.2(SO/SIO1)
SPI3_MOSI: D3.1(K) U7.5(SI/SIO0)
SPI3_SCK: D4.1(K) U7.6(SCK)
NetC18_1: C18.1 SW3.2(C) U6.7(WP)
NetC20_1: C20.1 SW4.2(C) U7.3(~{WP}/SIO2)
NetR11_1: R11.1 SW3.3
NetR12_1: R12.1 SW4.1

Not connected (* = marked no-connect by the designer): SW3 4(MNT_1)* 5(MNT_2)*; SW4 4(MNT_1)* 5(MNT_2)*; U5 1(NC) 2(NC) 3(NC) 7(NC)

### Notes on the sheet
- Non-Volatile Ferroelectric-RAM with a Write Protection Switch
- Serial Quad I/O Flash Memory with Write Protection Switch and ESD Protection Diodes
- PlusBit PCB ~ Extra Memory
- PlusBit-R1
- 1.0
- Nikolaos Isaak Bitsikas

### Library data of the parts
C16-C20 = CMP-2008-02046-2: as C5 on sheet PlusBit_MCU; Package: C0402-BB; Temperature: -55°C to +125°C; ComponentLink2Description: Datasheet; Temperature Characteristic: X5R; Device Class L1: Passive Components; Height: 0.55mm; Lead Free: Yes; ComponentLink2URL: https://content.kemet.com/datasheets/KEM_C1002_X7R_SMD.pdf; Device Class L2: Capacitors; Temperature Range Low: -55°C; Temperature Range High: +125°C; RoHS: TRUE; Octopart: https://octopart.com/c0402c104k8pactu-kemet-140039; Automotive: No; Mouser Description: Capacitor 100 nF 10 VDC 0402; Category: Cap; Voltage Rating: 10 V; Digikey Description: CAP CER 0.1UF 10V X5R 0402; Ipc Land Pattern Name: CAPC10050X50; Device Class L3: Ceramic Capacitors
D2-D4 = CMP-1063-00106-1: Transient Voltage Suppressor, Micro-Packaged Diode for ESD Protection, 2-Pin SOD-923, Pb-Free, Tape and Reel; Manufacturer: On Semiconductor; V(BR) Min (V): 5; Direction: Unidirectional; VRWM Max (V): 3.3; Number of Lines: 1; IR Max (uA): 2.5; ComponentLink3URL: http://www.onsemi.com/pub_link/Collateral/514AA.PDF; ComponentLink1URL: http://www.onsemi.com/; ComponentLink2Description: Datasheet; ComponentLink2URL: http://www.onsemi.cn/pub_link/Collateral/ESD9X3.3ST5G-D.PDF; PackageVersion: Rev. E, 03/2011; PackageReference: SOD-923-2-514AA-01; PartNumber: ESD9X3.3ST5G; Mounting Technology: Surface Mount; RoHS: Pb-Free; ComponentLink1Description: Manufacturer URL; Packing: Tape and Reel; ComponentLink3Description: Package Specification; DatasheetVersion: Rev. 7; PackageDescription: 2-Pin SOD, Body 0.8 x 0.6 mm
R11 R12 = CMP-2000-05022-1: as R8 on sheet PlusBit_MCU; Package Reference: 603; Series: RC; Case Code - mm: 1608; Packaging: Reel; Datasheet URL: http://www.farnell.com/datasheets/443971.pdf; Datasheet Version: Rev. 4, 04/2009; Operating Temperature Range: -55Cto+155C; Product: ThickFilmResistorsGeneralPurpose; Package Description: 2-Pin Surface Mount Device, Body 1.6 x 0.8 mm; Manufacturer URL: http://www.yageo.com/; Case Code - in: 0603; Tolerance: 5%; Termination Style: SMD/SMT
SW3 SW4 = CMP-10038-000025-1: SWITCH SLIDE SPDT 1MA 5V; Actuator Material: Nylon; Contact Resistance: 70mR; Electrical Life: 15000Cycles; Actuator Length: 1.5mm; Switch Function: On-On; Actuator Type: Standard; Actuator Color: Black; Current Rating: 1mA; Throw Configuration: SPDT; Termination: Gull Wing; Housing Material: Nylon; Max Operating Temperature: 85°C; Max Voltage Rating (DC): 5V; Voltage Rating (DC): 5V; Contact Plating: Silver; Radiation Hardening: No; Package Quantity: 1; REACH SVHC: No SVHC; RoHS Compliant: Yes; Orientation: Right Angle; Max Current Rating: 1mA; Case/Package: SMD/SMT; Contact Current Rating: 1mA; Contact Material: Copper Alloy; Mount: Surface Mount; Flammability Rating: UL94 V-2; Packaging: Tape and Reel; Switch Travel: 1.5mm; Length: 7.8mm; Series: JS; Min Operating Temperature: -20°C; Depth: 4.82mm
U5 = CMP-06260-000008-1: IC AUTHENTICATION CHIP
U6 = CMP-12945-000008-1: IC FRAM 256K I2C 1MHZ 8SOIC; Manufacturer: Cypress Semiconductor; Standoff Height: 0.1mm; Memory Size: 256Kbits; Min Supply Voltage: 2.7V; Interface: I2C,2-Wire; Max Supply Voltage: 5.5V; Memory Type: OTHER; Access Time: 0.55us; Nominal Supply Current: 100-400uA; Temperature: -40°C to +85°C; Digikey Description: IC FRAM 256K I2C 1MHZ 8SOIC; Device Class L2: Memory; ComponentLink2Description: Datasheet; Manufacturer Part Number: FM24W256-G; Ambient Temperature Range High: +85°C; Device Class L1: Integrated Circuits (ICs); Temperature Range High: +85°C; Footprint Url: https://www.cypress.com/file/42881/download; Frequency: 1MHz; Octopart: https://octopart.com/fm24w256-g-cypress+semiconductor-25377035; Ambient Temperature Range Low: -40°C; Temperature Range Low: -40°C; Category: IC; Mouser Description: F-RAM IIC FRAM 256k 3-5V F-RAM; Automotive: No; ComponentLink2URL: https://www.cypress.com/file/136451/download; Lead Free: Yes; Ipc Land Pattern Name: SOIC127P602X164-8; Package: 51-85066; RoHS: TRUE; Device Class L3: unset; Height: 1.727mm
U7 = CMP-00252-49237277-1: SST26VF016BT-104I/SM Flash Memory, SQI Flash Memory, 16Mb 1.8V; Access Time: 8ns; Interface: SPI; Memory Size: 2MB; Page Size: 256B; Frequency: 104MHz; Max Supply Voltage: 3.6V; Min Supply Voltage: 2.7V; Memory Type: FLASH; Height: 2.03mm; Density: 16Mb; Schedule B: 8542320050, 8542320050; Lifecycle Status: Production; Mount: Surface Mount; Packaging: Tape & Reel (TR); Number of Pins: 8; RoHS: Compliant; Max Operating Temperature: 85°C; Min Operating Temperature: -40°C; Case/Package: SOIC; NexarPartId: 49237277; Contact Plating: Tin

## Sheet PlusBit_Sensors.SchDoc
size A4; SheetNumber: 5; SheetTotal: 5
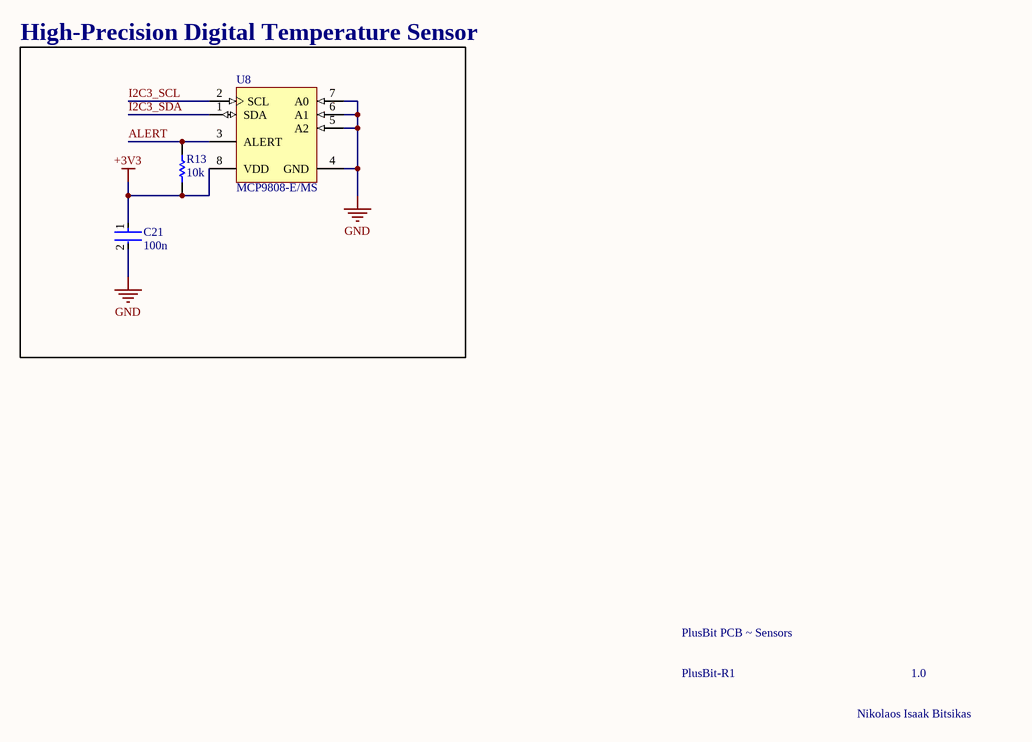
[diagram p4: PlusBit_Sensors.SchDoc]

### Parts
C21  100n  [FP-C0402-BB-MFG]
R13  10k  [RESC1608X55X25ML10T15]
U8  MCP9808-E/MS  [MCHP-MSOP-MS8_L]

### Blocks framed on the sheet
High-Precision Digital Temperature Sensor: C21 R13 U8

### Nets
+3V3: C21.1 R13.1 U8.8(VDD)
GND: C21.2 U8.4(GND) U8.5(A2) U8.6(A1) U8.7(A0)
ALERT: R13.2 U8.3(ALERT)
I2C3_SCL: U8.2(SCL)
I2C3_SDA: U8.1(SDA)

### Notes on the sheet
- PlusBit PCB ~ Sensors
- PlusBit-R1
- 1.0
- Nikolaos Isaak Bitsikas

### Library data of the parts
C21 = CMP-2008-02046-2: as C5 on sheet PlusBit_MCU; Package: C0402-BB; Temperature: -55°C to +125°C; ComponentLink2Description: Datasheet; Temperature Characteristic: X5R; Device Class L1: Passive Components; Height: 0.55mm; Lead Free: Yes; ComponentLink2URL: https://content.kemet.com/datasheets/KEM_C1002_X7R_SMD.pdf; Device Class L2: Capacitors; Temperature Range Low: -55°C; Temperature Range High: +125°C; RoHS: TRUE; Octopart: https://octopart.com/c0402c104k8pactu-kemet-140039; Automotive: No; Mouser Description: Capacitor 100 nF 10 VDC 0402; Category: Cap; Voltage Rating: 10 V; Digikey Description: CAP CER 0.1UF 10V X5R 0402; Ipc Land Pattern Name: CAPC10050X50; Device Class L3: Ceramic Capacitors
R13 = CMP-2000-05022-1: as R8 on sheet PlusBit_MCU; Package Reference: 603; Series: RC; Case Code - mm: 1608; Packaging: Reel; Datasheet URL: http://www.farnell.com/datasheets/443971.pdf; Datasheet Version: Rev. 4, 04/2009; Operating Temperature Range: -55Cto+155C; Product: ThickFilmResistorsGeneralPurpose; Package Description: 2-Pin Surface Mount Device, Body 1.6 x 0.8 mm; Manufacturer URL: http://www.yageo.com/; Case Code - in: 0603; Tolerance: 5%; Termination Style: SMD/SMT
U8 = CMP-0192-00344-1: + / - 0.5 degC Maximum Accuracy Digital Temperature Sensor, 400 uA, 2.7 to 5.5 V, -40 to 125 degC, 8-pin MSOP (MS8), Tube; Manufacturer: Microchip; ComponentLink3Description: Package Specification; ComponentLink4URL: http://www.microchip.com/MCP9808; PackageDescription: 8-Lead Plastic Micro Small Outline Package, 3 x 3 mm Body, 0.65 mm Pitch; ComponentLink2Description: Datasheet; PartNumber: MCP9808-E/MS; Mounting Technology: Surface Mount; ComponentLink4Description: Product URL; ComponentLink1Description: Manufacturer URL; ComponentLink2URL: http://ww1.microchip.com/downloads/en/DeviceDoc/25095A.pdf; ComponentLink3URL: http://www.microchip.com/stellent/groups/techpub_sg/documents/packagingspec/en012702.pdf; DatasheetVersion: Rev. A; ComponentLink1URL: http://www.microchip.com; PackageReference: MSOP-MS8; PackageVersion: C04-111C

## Nets that join several sheets
+3V3: PlusBit_MCU (22 pins), PlusBit_PowerSupply (C13.1 L1.2 R9.2 U2.5), PlusBit_ExtraModule (C14.2 C15.1 MD1.2 R10.2), PlusBit_ExtraMemory (8 pins), PlusBit_Sensors (C21.1 R13.1 U8.8)
GND: PlusBit_MCU (24 pins), PlusBit_PowerSupply (12 pins), PlusBit_ExtraModule (8 pins), PlusBit_ExtraMemory (19 pins), PlusBit_Sensors (5 pins)
ALERT: PlusBit_MCU (U1.37), PlusBit_Sensors (R13.2 U8.3)
FMPI2C1_SCK: PlusBit_MCU (R5.1 U1.39), PlusBit_ExtraMemory (U6.6)
FMPI2C1_SDA: PlusBit_MCU (R4.1 U1.38), PlusBit_ExtraMemory (U6.5)
I2C1_SCK: PlusBit_MCU (R1.1 U1.58), PlusBit_ExtraMemory (U5.6)
I2C1_SDA: PlusBit_MCU (R2.1 U1.59), PlusBit_ExtraMemory (U5.5)
I2C3_SCL: PlusBit_MCU (R3.1 U1.41), PlusBit_Sensors (U8.2)
I2C3_SDA: PlusBit_MCU (R6.1 U1.40), PlusBit_Sensors (U8.1)
SPI3_MISO: PlusBit_MCU (U1.52), PlusBit_ExtraMemory (D2.1 U7.2)
SPI3_MOSI: PlusBit_MCU (U1.53), PlusBit_ExtraMemory (D3.1 U7.5)
SPI3_SCK: PlusBit_MCU (U1.51), PlusBit_ExtraMemory (D4.1 U7.6)
USART_RX: PlusBit_MCU (U1.17), PlusBit_ExtraModule (MD1.35)
USART_TX: PlusBit_MCU (U1.16), PlusBit_ExtraModule (MD1.34)
USB_N: PlusBit_MCU (U1.44), PlusBit_PowerSupply (J1.A7 U3.6)
USB_P: PlusBit_MCU (U1.45), PlusBit_PowerSupply (J1.A6 U3.3)